# Altium schematic sheet LM399_Reference.SchDoc
size A
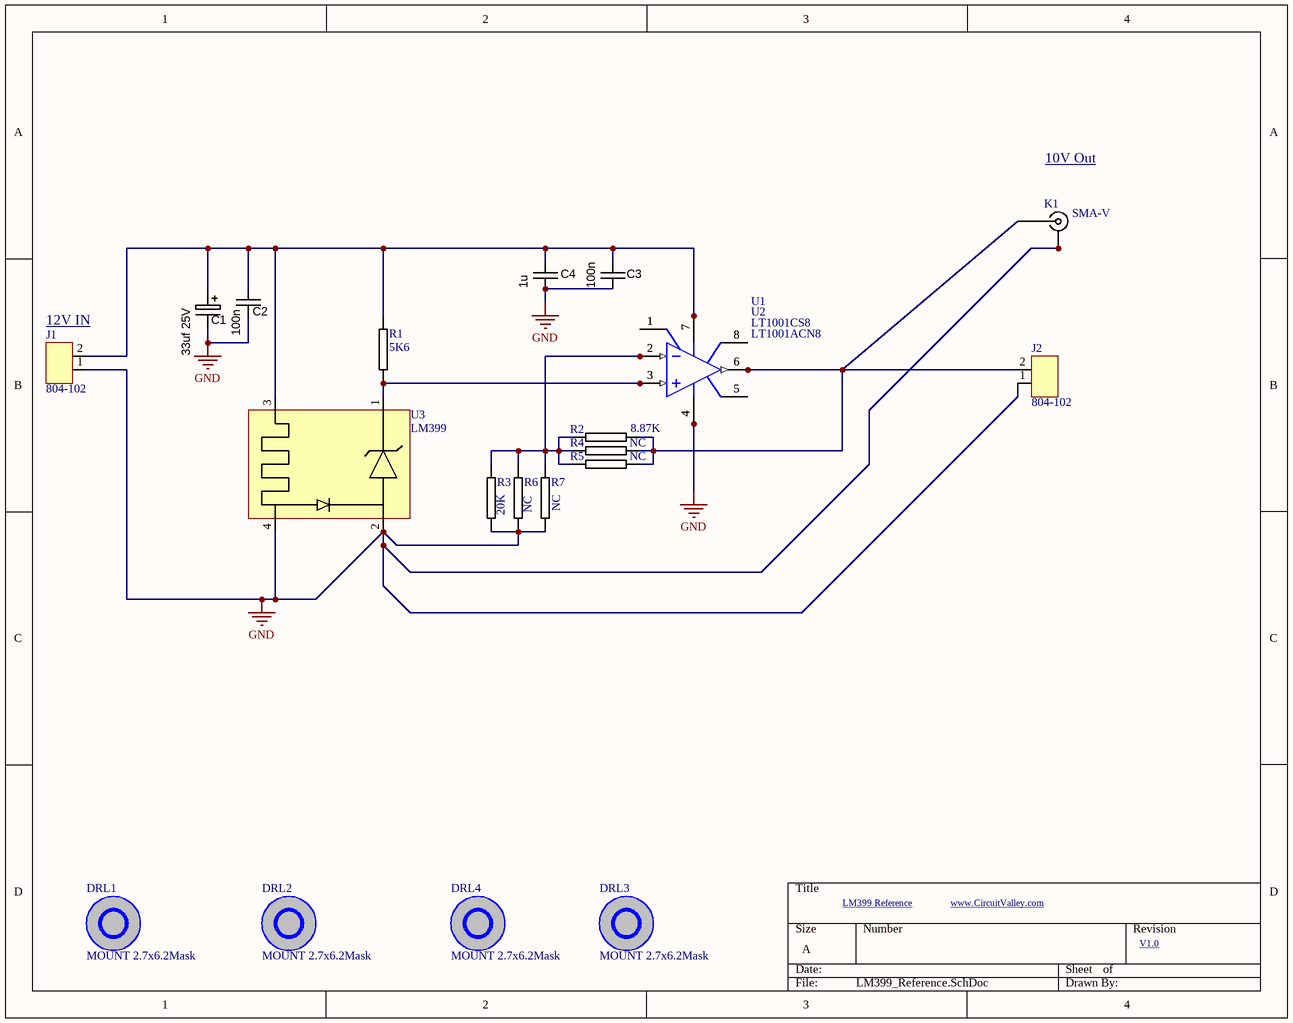
[diagram p0: LM399_Reference.SchDoc]

## Parts
C1  value 33uf 25V  [CAPMP7343X310N]  (hidden comment: 33uf 20V D)
C2  100n  [CAPC1608N]
C3  100n  [CAPC1608N]
C4  1u  [CAPC1608N]
DRL1  MOUNT 2.7x6.2Mask  [NO_COPPER_NOMASK_2m75_6m2]
DRL2  MOUNT 2.7x6.2Mask  [NO_COPPER_NOMASK_2m75_6m2]
DRL3  MOUNT 2.7x6.2Mask  [NO_COPPER_NOMASK_2m75_6m2]
DRL4  MOUNT 2.7x6.2Mask  [NO_COPPER_NOMASK_2m75_6m2]
J1  804-102  [804-102]
J2  804-102  [804-102]
K1  SMA-V  [SMA-V]
R1  5K6  [0603R-GENERIC]
R2  8.87K  [0603R-TBD]
R3  20K  [0603R-GENERIC]
R4  NC  [0603R-TBD]
R5  NC  [0603R-TBD]
R6  NC  [0603R-GENERIC]
R7  NC  [0603R-GENERIC]
U1  LT1001CS8  [S8_N]
U2  LT1001ACN8  [N8]
U3  LM399  [TO-46]

## Nets
GND: C1.2 C2.1 C3.1 C4.1 J1.1(PW) J2.1(PW) K1.2 K1.3 K1.4 K1.5 R3.1 R6.1 R7.1 U1.4(V-) U2.4(V-) U3.2(D2) U3.4(H2)
NetC1_1: C1.1 C2.2 C3.2 C4.2 J1.2(PW) R1.1 U1.7(V+) U2.7(V+) U3.3(H1)
NetJ2_2: J2.2(PW) K1.1 R2.2 R4.2 R5.2 U1.6(OUT) U2.6(OUT)
NetR1_2: R1.2 U1.3(IN+) U2.3(IN+) U3.1(D1)
NetR2_1: R2.1 R3.2 R4.1 R5.1 R6.2 R7.2 U1.2(IN-) U2.2(IN-)
NetU1_1: U1.1(VOSTRIM) U2.1(VOSTRIM)
NetU1_5: U1.5(NC) U2.5(NC)
NetU1_8: U1.8(VOSTRIM) U2.8(VOSTRIM)

## Notes on the sheet
- 10V Out
- (near J1) 12V IN
- LM399 Reference
- www.CircuitValley.com
- V1.0

## Library data of the parts
C1 = CAPT_330u_2917_6V3: Capacitor SMD Tant 330uF 20% 6V3 2917; Manufacturer Part Number: T520D337M006ATE015; Part: TAJD336K020R; Ratings: 6.3V; Material: Solid Tantalum; ESR (Equivalent Series Resistance): 15 mOhm; Package / Case: 2917 (7343 Metric); Tolerance: ±20%; Operating Temperature: -55°C ~ 125°C; Size / Dimension: 0.287" L x 0.169" W (7.30mm x 4.30mm); Height - Seated (Max): 0.122" (3.10mm); Manufacturer Size Code: D; Supplier 1: Digi-Key; Supplier Part Number 1: 399-4052-1-ND; ComponentLink1URL: http://www.kemet.com/datasheets&T520D337M006ATE015; ComponentLink1Description: T520D Datasheet
C2 C4 = CAPC_10p_0603_NP0_1%_50V: Capacitor SMD Cer 10pF 5% 50V NP0 0603; Manufacturer 1: Murata Electronics North America; Manufacturer Part Number 1: GRM1885C1H100FA01J; Part: C0603X104K5RAC; Ratings: 50V; NP0; Tolerance: ±5%; Operating Temperature: -55°C ~ 125°C; Package / Case: 0603 (1608 Metric); Size / Dimension: 0.063" L x 0.032" W (1.60mm x 0.81mm); Thickness (Max): 0.035" (0.90mm); Supplier 1: Digi-Key; Supplier Part Number 1: GRM1885C1H100FA01J-ND
  C2: Value: 100n
  C4: Value: 1u
C3 = CAPC_10p_0603_NP0_1%_50V: Capacitor SMD Cer 10pF 5% 50V NP0 0603; Part: C0603X104K5RAC; Value: 100n
DRL1-DRL4 = DRILL_2.7x6.2Mask_NOCOPPER
K1 = SMA-V: SMA THREADED RF CONNECTOR VERTICAL
R1 = 0603R-7K5: GENERIC RESISTOR 0603; Part: RMCF0603JT7K50
R2 R4 R5 = 0603R-TBD: RESISTOR 0603 VALUE TO BE DETERMINED; Part: RN73C1J8K87BTG
R3 R6 R7 = 0603R-20K: GENERIC RESISTOR 0603; Part: ERA-3ARW203V
U1 = LT1001CS8: General Purpose, High Precision Op Amp; Part: LT100ACN8
U2 = LT1001ACN8: General Purpose, High Precision Op Amp; Note: Pin 5 is NC (not internally connected) pin.; Note: 56; Published: 8-Jun-2000; LatestRevisionDate: 29-May-2009; LatestRevisionNote: Component Body Added.; DatasheetVersion: 1990; PackageVersion: N8 1002; PackageReference: N8; Publisher: Altium Limited; PackageDescription: DIP, Plastic, 8-Pin, Row Spacing 7.62 mm, Pitch 2.54 mm; ComponentLink1Description: Manufacturer Link; ComponentLink1URL: http://www.linear.com/; ComponentLink2Description: Datasheet; ComponentLink2URL: http://www.linear.com/pc/downloadDocument.do?navId=H0,C1,C1154,C1009,C1021,P1206,D1672
J1 J2 = 804-102: Part: 804-102
U3 = LM399: Part: LM399